# EAGLE design aufsatz_v2.1_usb (EAGLE 6.5.0)
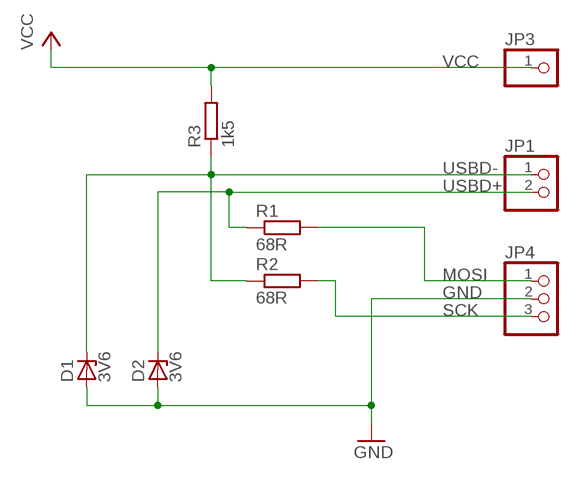
[diagram p0: schematic, sheet 1]

## Parts
D1  3V6  ZENER-DIODESOD80C  [SOD80C]
D2  3V6  ZENER-DIODESOD80C  [SOD80C]
JP1  PINHD-1X2  [1X02]
JP3  PINHD-1X1  [1X01]
JP4  PINHD-1X3  [1X03]
R1  68R  R-EU_R0805  [R0805]
R2  68R  R-EU_R0805  [R0805]
R3  1k5  R-EU_R0805  [R0805]

## Nets
GND: D1.A D2.A JP4.2
MOSI: JP4.1 R1.2
SCK: JP4.3 R2.2
USBD+: D2.C JP1.2 R1.1
USBD-: D1.C JP1.1 R2.1 R3.1
VCC: JP3.1 R3.2

## Library data of the parts
D1 D2 = diode:ZENER-DIODE: Z-Diode
JP1 = pinhead:PINHD-1X2: PIN HEADER
JP3 = pinhead:PINHD-1X1: PIN HEADER
JP4 = pinhead:PINHD-1X3: PIN HEADER
R1-R3 = rcl:R-EU_: RESISTOR, European symbol

## Board
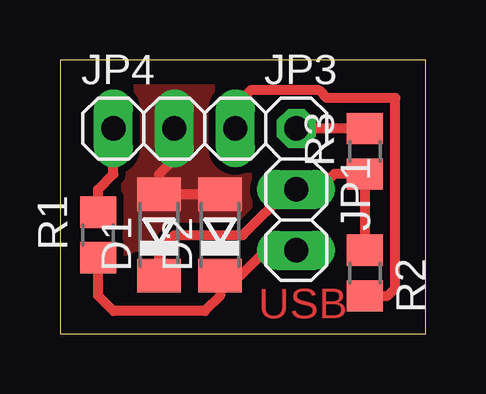
[diagram p1: board, top side]

Size 15.24 x 11.43 mm. Coordinates in mm from the lower left corner, seen from the top.
Outline: 0,0 15.24,0 15.24,11.43 0,11.43 0,0
Copper layers (1*16): Top 0.035mm / dielectric 1.5mm / Bottom 0.035mm
Design rules "starterkit_v2": minimum track width 12mil, minimum drill 24mil, track to track 12mil, track to pad 12mil, pad to pad 12mil, via to via 12mil, smd to smd 8mil, copper to edge 40mil, drill to drill 12mil, minimum pad ring 12mil, minimum via ring 12mil, stop-mask expansion 4mil, vias tented up to drill 0mil, thermal gap 10mil

### Footprints (pad centres in the part's own frame; a part is rotated, then mirrored left to right if it is on the bottom)
SOD80C = smd 1.4 x 1.8: A 1.7,0; C -1.7,0
1X02 = drill 1.016 long: 1 -1.27,0; 2 1.27,0
1X01 = drill 1.016 octagon: 1 0,0
1X03 = drill 1.016 long: 1 -2.54,0; 2 0,0; 3 2.54,0
R0805 = smd 1.3 x 1.5: 1 -0.95,0; 2 0.95,0

### Placement (x,y rotation side)
D1  4.13,4.13 90 top
D2  6.67,4.13 90 top
JP1  9.84,4.76 270 top
JP3  9.84,8.57 0 top
JP4  4.76,8.57 0 top
R1  1.59,4.13 90 top
R2  12.7,2.54 270 top
R3  12.7,7.62 90 top

### Tracks (layer width: path | path; a pad name or v marks a point on that pad's centre or on a via)
GND
  Top 0.406: D2.A D1.A 4.13,6.67 4.76,7.3 JP4.2
  pour Top (no thermals): 0,11.43 15.24,11.43 15.24,0 0,0
MOSI
  Top 0.406: R1.2 1.59,6.03 2.22,6.67 JP4.1
SCK
  Top 0.406: R2.2 13.65,1.59 13.97,1.91 13.97,9.84 11.11,9.84 10.79,10.16 7.94,10.16 7.3,9.53 JP4.3
USBD+
  Top 0.406: R1.1 1.59,1.59 2.22,0.95 6.03,0.95 6.67,1.59 D2.C 7.51,2.43 8.57,3.49 JP1.2
USBD-
  Top 0.406: D1.C 4.13,3.49 4.76,4.13 7.62,4.13 9.53,6.03 JP1.1 10.79,6.03 11.43,6.67 R3.1 R2.1
VCC
  Top 0.406: R3.2 13.02,8.57 JP3.1

### Text on the board
Top: USB